# EasyEDA Pro project easyeda.eprj, schematic bl808_m1s

## Sheets
1 bl808_m1s
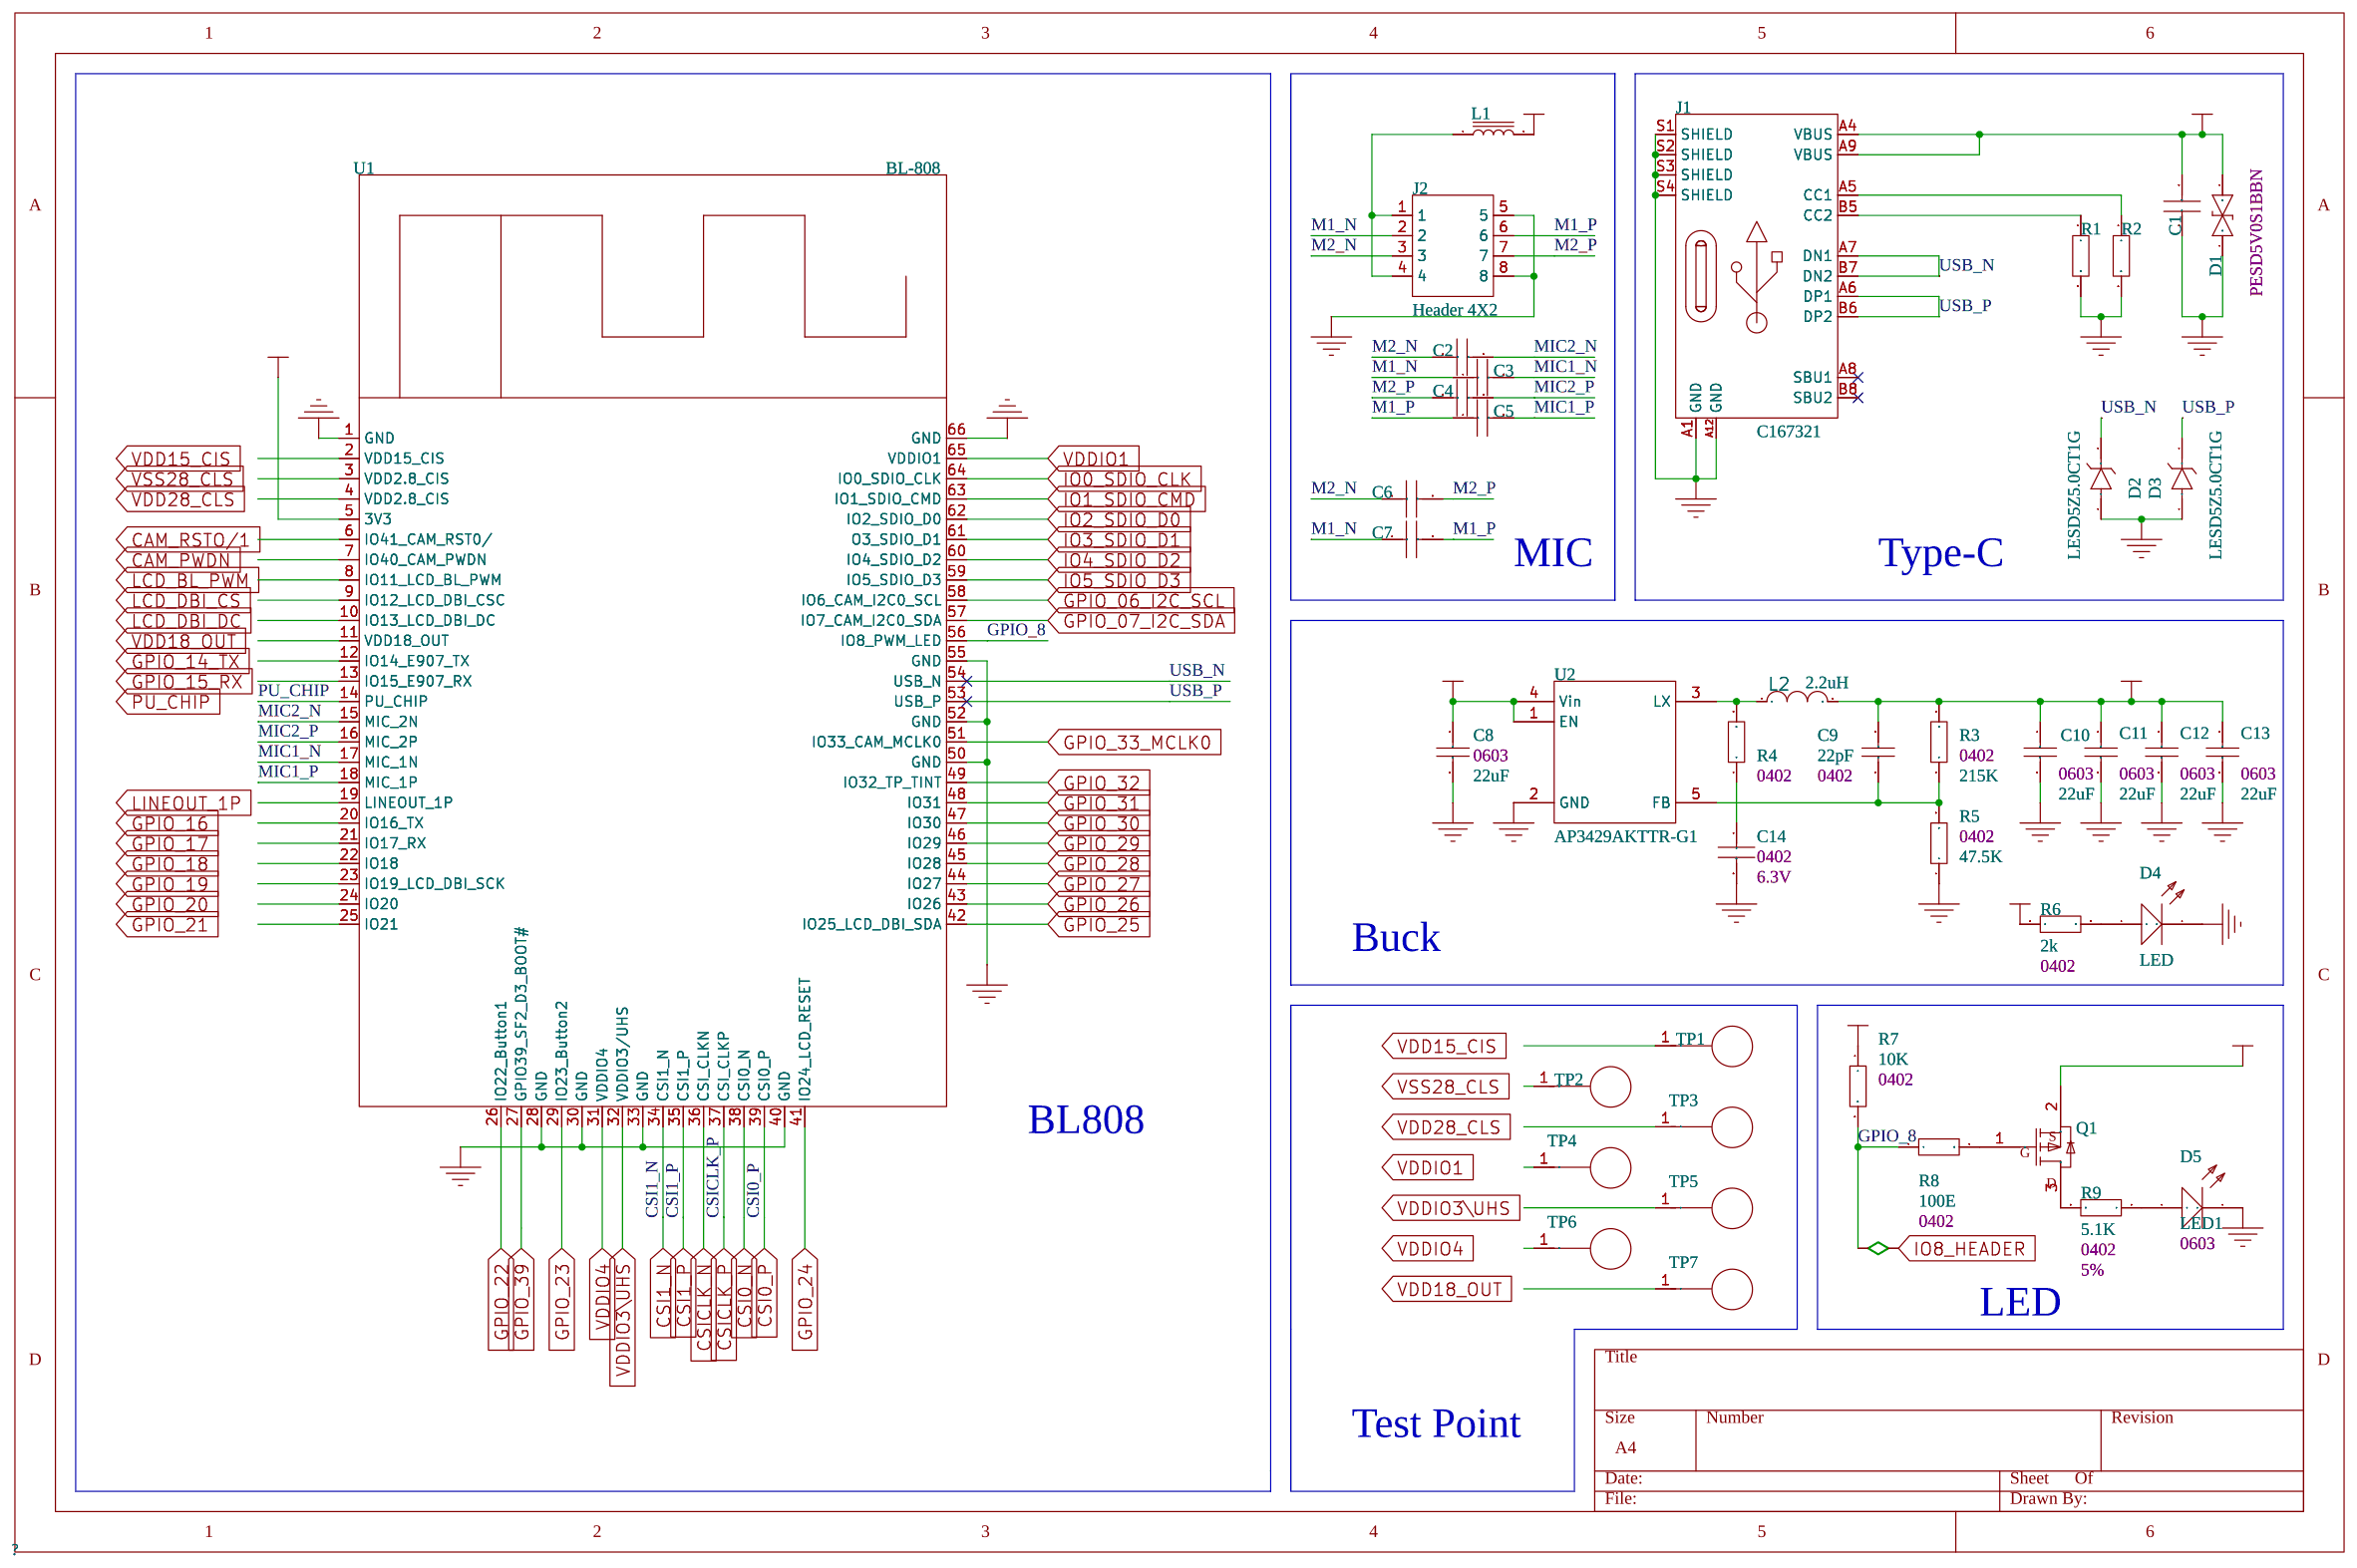
[diagram p0: bl808_m1s]
2 CAM_DISP
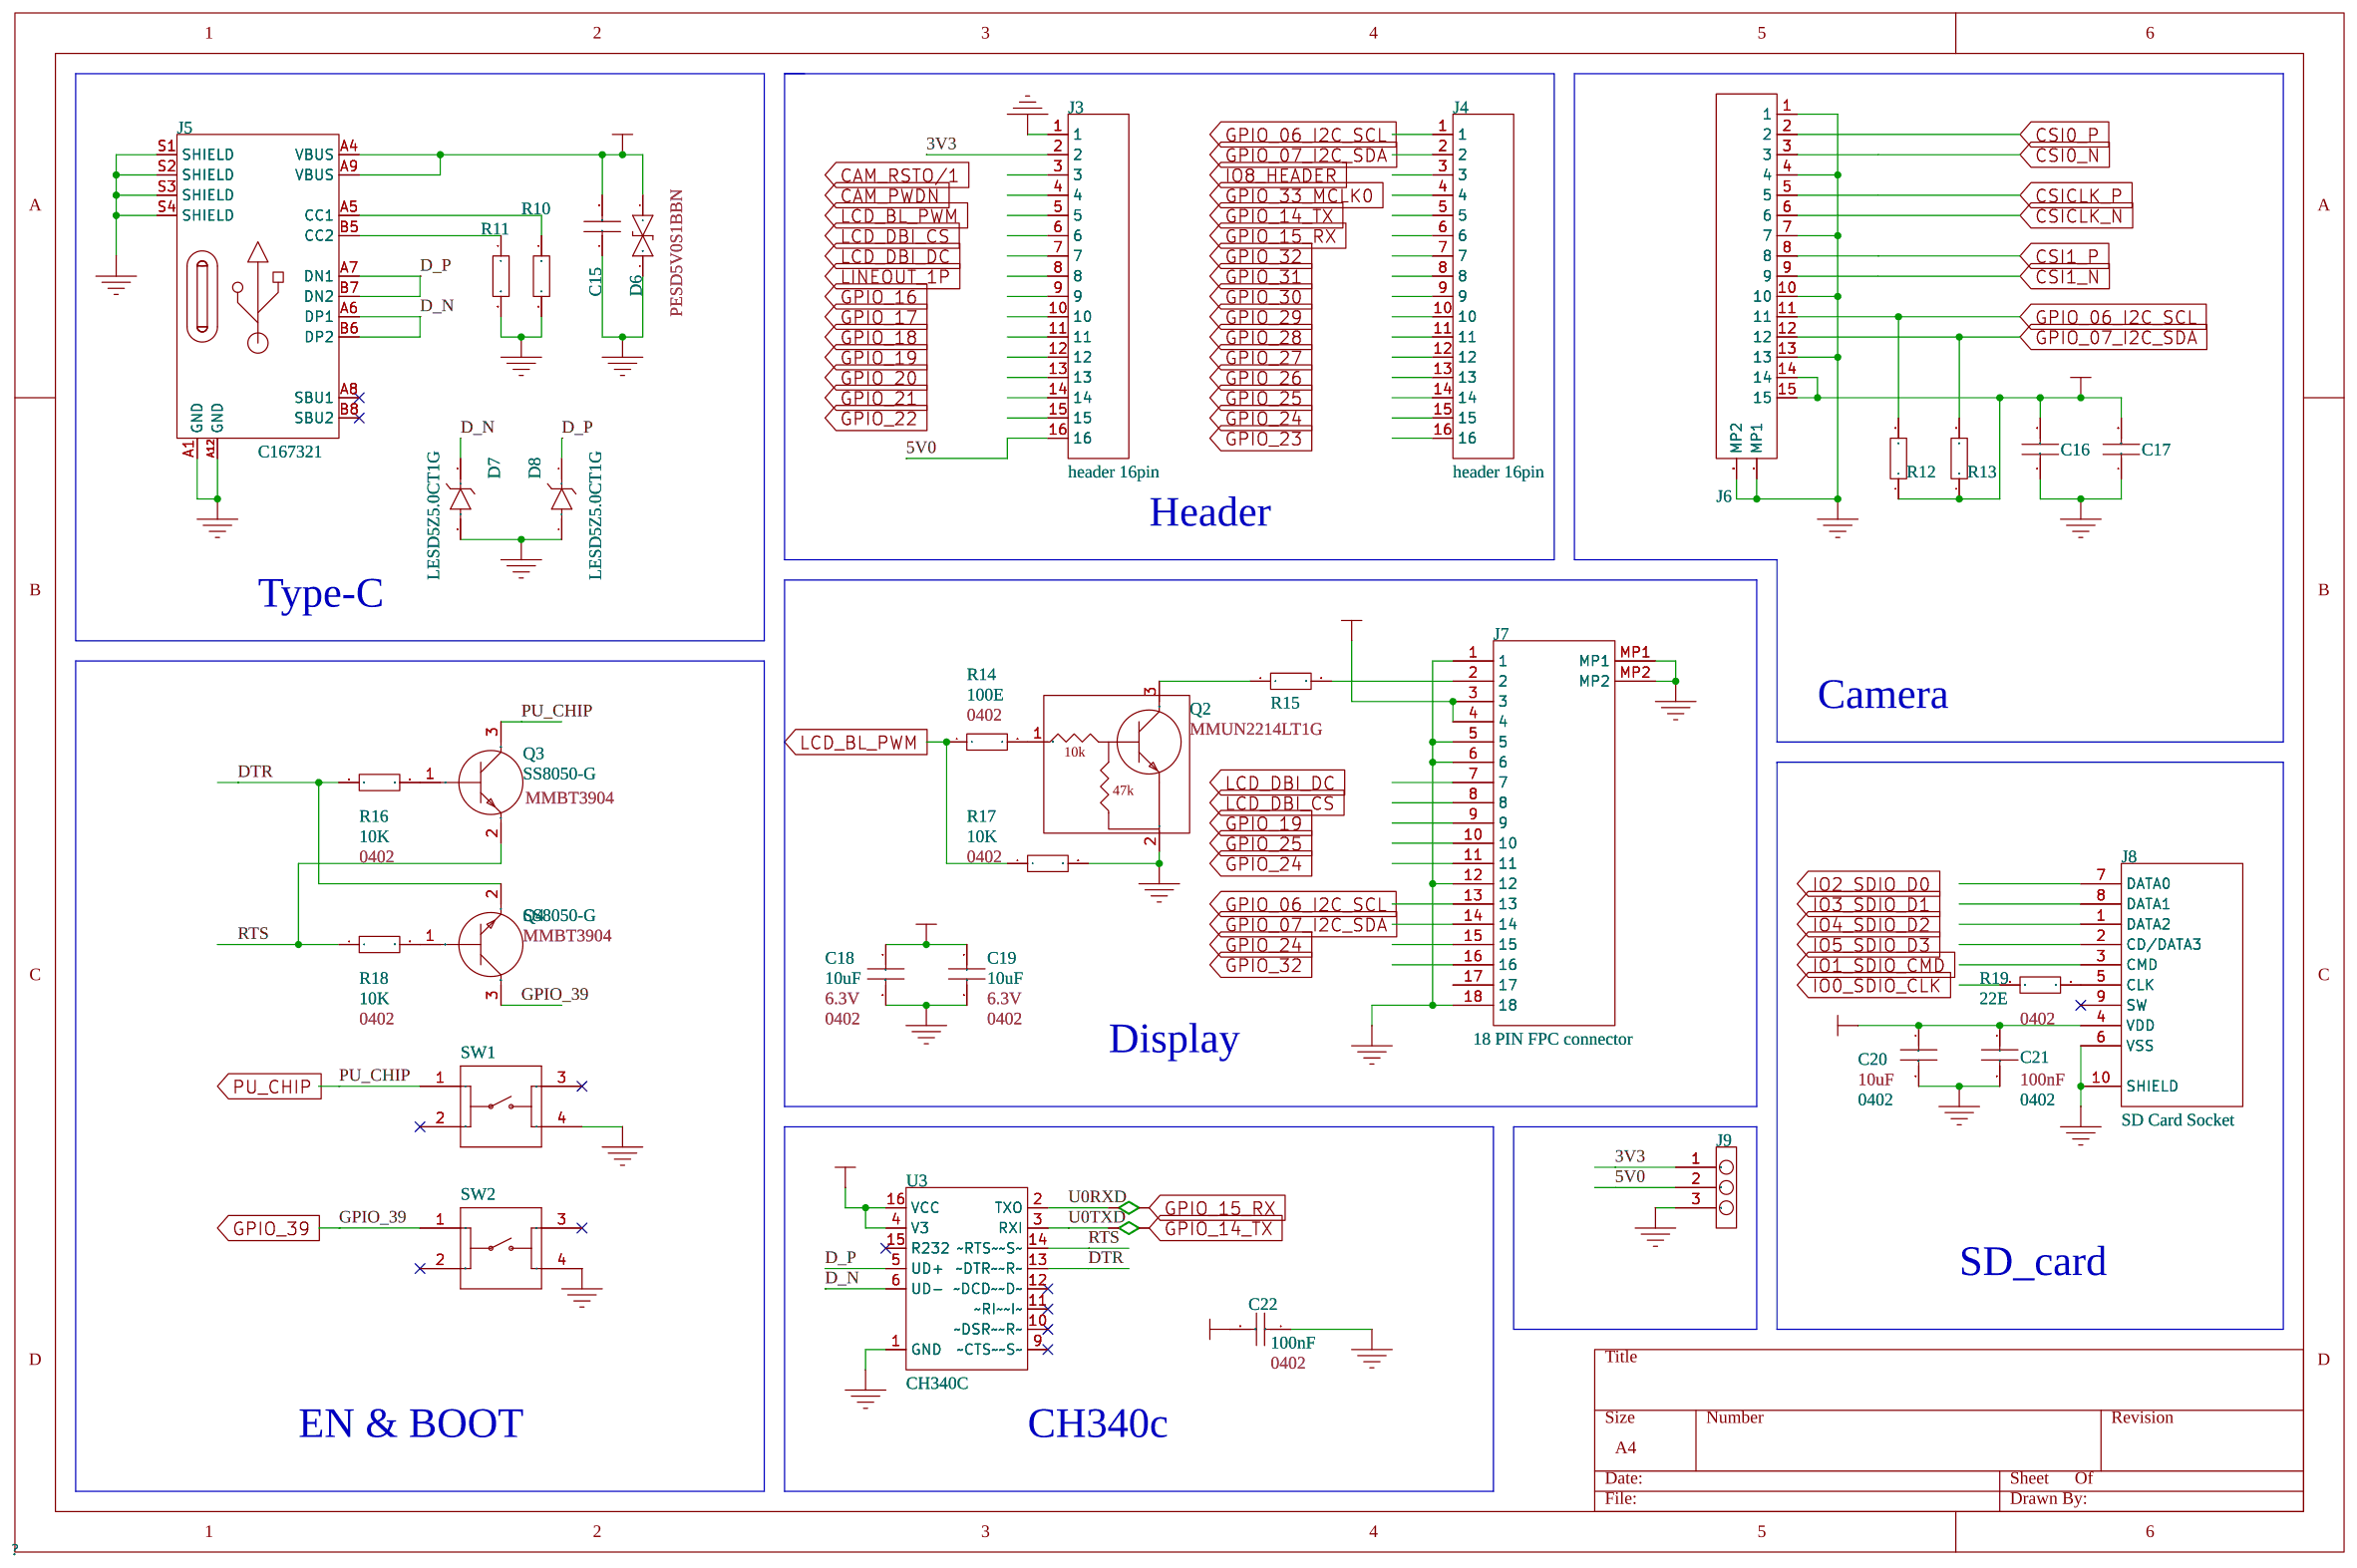
[diagram p1: CAM_DISP]

## Parts
sheet bl808_m1s
C1  22uF  [capc0805]
C2  100nF  [capc0805]
C3  100nF  [capc0805]
C4  100nF  [capc0805]
C5  100nF  [capc0805]
C6  *  [CAPC0402]
C7  *  [CAPC0402]
C8  22uF  [capc0603]
C9  22pF  [capc0402]
C10  22uF  [capc0603]
C11  22uF  [capc0603]
C12  22uF  [capc0603]
C13  22uF  [capc0603]
C14  *  [capc0805]
D1  PESD5V0S1BBN  [sod523]
D2  LESD5Z5.0CT1G  [sod523]
D3  LESD5Z5.0CT1G  [sod523]
D4  LED  [led_0603]
D5  LED1  [led_0603]
J1  C167321  [TYPE-C_usb]
J2  Header 4X2  [Header 2X4]
L1  Ferrite Bead  [C0805]
L2  2.2uH  [IND_4.0X4.0X2.0]
Q1  C148354  [SOT-23]
R1  5.1K  [resc0402]
R2  5.1K  [resc0402]
R3  215K  [resc0402]
R4  *  [resc0402]
R5  47.5K  [resc0402]
R6  2k  [resc0402]
R7  10K  [resc0402]
R8  100E  [resc0402]
R9  5.1K  [resc0402]
TP1  Test_Point  [TESTPOINT SMD]
TP2  Test_Point  [TESTPOINT SMD]
TP3  Test_Point  [TESTPOINT SMD]
TP4  Test_Point  [TESTPOINT SMD]
TP5  Test_Point  [TESTPOINT SMD]
TP6  Test_Point  [TESTPOINT SMD]
TP7  Test_Point  [TESTPOINT SMD]
U1  BL-808  [BL808 MODULE]
U2  AP3429AKTTR-G1  [SOT23-5]
sheet CAM_DISP
C15  22uF  [capc0805]
C16  22uF  [capc0805]
C17  22uF  [capc0805]
C18  10uF  [capc0805]
C19  10uF  [capc0805]
C20  0402  [capc0805]
C21  0402  [capc0805]
C22  100nF  [CAPC0402]
D6  PESD5V0S1BBN  [sod523]
D7  LESD5Z5.0CT1G  [sod523]
D8  LESD5Z5.0CT1G  [sod523]
J3  header 16pin  [HEADER 16 PIN 2.54]
J4  header 16pin  [HEADER 16 PIN 2.54]
J5  C167321  [TYPE-C_usb]
J6  MIPI  [15pin FPC conn hoirzontal]
J7  18 PIN FPC connector  [18 pin fpc]
J8  SD Card Socket  [SD card socket_MIX]
J9  Header 3 pin  [3 pin header]
Q2  Transistor NPN  [SOT95P240X115-3N]
Q3  SS8050-G  [SOT23-3]
Q4  SS8050-G  [SOT23-3]
R10  5.1K  [resc0402]
R11  5.1K  [resc0402]
R12  5.1K  [resc0402]
R13  10K  [resc0402]
R14  100E  [resc0402]
R15  5.1E  [resc0402]
R16  10K  [resc0402]
R17  10K  [resc0402]
R18  10K  [resc0402]
R19  22E  [resc0402]
SW1  Switch  [Micro Push Button 4 PAD]
SW2  Switch  [Micro Push Button 4 PAD]
U3  *  [ch340c]

## Library data of the parts
C1 = Cap: CAP CER 22uF 10V X5R 0402; Manufacturer Part Number: *; Voltage: 10v; Dielectric: *; Case/Package: 0805; Library Name: CUSTOM SCH
C2-C5 = Cap: CAP CER 100nF 3.3V X7R 0402; Manufacturer Part Number: *; Voltage: 3.3V; Dielectric: *; Case/Package: 0402; Library Name: CUSTOM SCH
C6 C7 = DNP: CAP CER uF 10V X5R 0402; Design Item ID: Cap; Library Name: CUSTOM SCH
C8 C10-C13 = Capacitor: CAP CER 22uF 10V X5R 0805; Manufacturer Part Number: *; Case/Package: 0603; Origin Footprint 2: CAPC0805; Library Name: Pd&apos;s Sch Lib
C9 = Capacitor: CAP CER 22pF 50V C0G 0402; Manufacturer Part Number: *; Case/Package: 0402; Origin Footprint 1: CAPC0402; Library Name: Pd&apos;s Sch Lib
C14 = Cap: CAP CER uF 10V X5R 0402; Voltage: 6.3V; Case/Package: 0402; Origin Footprint 1: capc0402; Library Name: CUSTOM SCH; Origin Footprint 2: capc0402
D1 D6 = PESD5V0S1BBN: 5V 6.5V Bidirectional 14V 3.5A (8/20us) SOD-523 TVS; Case/Package: SOD-523; Design Item ID: Bidirectional ESD Diode; Library Name: trolley
D2 D3 D7 D8 = LESD5Z5.0CT1G: ESD protection; Design Item ID: ESD DIODE_1; Library Name: CUSTOM SCH
D4 = LED: Case/Package: 0603; Library Name: Pd&apos;s Sch Lib
D5 = LED1: Typical RED GaAs LED; Manufacturer Part Number: LED; Case/Package: 0603; Library Name: CUSTOM SCH
J1 J5 = C167321: Type-C SMD USB Connectors,3A 16P Female; Manufacturer Part Number: 918-418K2023S40001; Case/Package: SMD; Design Item ID: TYPE-C; Library Name: CUSTOM SCH
J2 = Header 4X2: Headers &amp; Wire Housings ECONOSTIK HEADER DR VT TH 2X4; Case/Package: TH; Manufacturer Part Number: 10129381-908002BLF; Library Name: CUSTOM SCH
L1 = Ferrite Bead: Ferrite Beads 120ohms@100MHz 2A 0402; ComponentLink1URL: http://www.farnell.com/datasheets/1685938.pdf?src-supplier=Element14; ComponentLink1Description: http://www.farnell.com/datasheets/1685938.pdf?src-supplier=Element14; ComponentLink2URL: https://assets.lairdtech.com/home/brandworld/files/LI0805H151R-10.pdf?src-supplier=Digi-Key; ComponentLink2Description: https://assets.lairdtech.com/home/brandworld/files/LI0805H151R-10.pdf?src-supplier=Digi-Key; ComponentLink3URL: https://www.alliedelec.com/m/d/63159f83fbe70e1160794b0cc8ac128f.pdf?src-supplier=Allied+Electronics; ComponentLink3Description: https://www.alliedelec.com/m/d/63159f83fbe70e1160794b0cc8ac128f.pdf?src-supplier=Allied+Electronics; Manufacturer Part Number: MPZ1005S121HT000; Current: 2A; Impedance @ Frequency: 120ohms; Case/Package: 0402; Library Name: CUSTOM SCH
L2 = Inductor: SMD Power Inductors RoHS; Manufacturer Part Number: SRN4018-2R2M; Library Name: Pd&apos;s Sch Lib
Q1 = C148354: P-Channel -20V, -7.1A, 19m?, SOT-23; ComponentLink1URL: http://www.vishay.com/docs/68645/si2302cd.pdf?src-supplier=Avnet; ComponentLink1Description: http://www.vishay.com/docs/68645/si2302cd.pdf?src-supplier=Avnet; ComponentLink2URL: http://www.farnell.com/datasheets/1719572.pdf?src-supplier=Element14; ComponentLink2Description: http://www.farnell.com/datasheets/1719572.pdf?src-supplier=Element14; ComponentLink3URL: http://www.vishay.com/docs/68645/si2302cd.pdf?src-supplier=Future+Electronics; ComponentLink3Description: http://www.vishay.com/docs/68645/si2302cd.pdf?src-supplier=Future+Electronics; ComponentLink4URL: http://www.vishay.com/docs/68645/si2302cds.pdf?src-supplier=Digi-Key; ComponentLink4Description: http://www.vishay.com/docs/68645/si2302cds.pdf?src-supplier=Digi-Key; Manufacturer Part Number: WST2339; ComponentLink5URL: http://www.mccsemi.com/up_pdf/SI2302(SOT-23).pdf?src-supplier=Digi-Key; ComponentLink5Description: http://www.mccsemi.com/up_pdf/SI2302(SOT-23).pdf?src-supplier=Digi-Key; Origin Footprint 2: SOT95P240X115-3N; Design Item ID: MOSFET PMOS; Library Name: CUSTOM SCH
R1 R2 = RES: Thick Film Resistor -  5.1kohm, 1%, 0402; Manufacturer Part Number: *; Case/Package: 0402; Tolerance: *; Origin Footprint 2: RESC0402; Library Name: CUSTOM SCH
R3 = RES: Thick Film Resistor -  215kohm, 1%, 0402; Manufacturer Part Number: *; Case/Package: 0402; Tolerance: *; Origin Footprint 2: RESC0402; Library Name: CUSTOM SCH
R4 = RES: Thick Film Resistor -  ohm, 1%, 0402; Case/Package: 0402; Library Name: CUSTOM SCH; Origin Footprint 3: RESC0402
R5 = RES: Thick Film Resistor -  47.5kohm, 1%, 0402; Manufacturer Part Number: *; Case/Package: 0402; Tolerance: *; Origin Footprint 2: RESC0402; Library Name: CUSTOM SCH
R6 = RES: Thick Film Resistor -  2kohm, 1%, 0402; Manufacturer Part Number: *; Case/Package: 0402; Tolerance: *; Origin Footprint 2: RESC0402; Library Name: CUSTOM SCH
R7 = RES: Thick Film Resistor -  10kohm, 1%, 0402; Manufacturer Part Number: *; Case/Package: 0402; Tolerance: *; Origin Footprint 2: RESC0402; Library Name: CUSTOM SCH
R8 R14 = RES: Thick Film Resistor -  100ohm, 1%, 0402; Manufacturer Part Number: *; Case/Package: 0402; Tolerance: *; Origin Footprint 2: RESC0402; Library Name: CUSTOM SCH
R9 = RES: Thick Film Resistor - 5.1kohm, 1%, 0402; Manufacturer Part Number: *; Case/Package: 0402; Tolerance: 5%; Origin Footprint 2: RESC0201; Origin Footprint 1: RESC0402; Library Name: CUSTOM SCH; Origin Footprint 4: RESC0402
TP1-TP7 = Test_Point: Library Name: CUSTOM SCH
U1 = BL-808: Library Name: CUSTOM SCH
U2 = AP3429AKTTR-G1: IC REG BUCK ADJ 2A SYNC TSOT25; Case/Package: SOT-23-5; Library Name: Pd&apos;s Sch Lib
C15 = Cap: CAP CER 22uF 10V X5R 0402; Manufacturer Part Number: *; Voltage: 10V; Dielectric: *; Case/Package: 0805; Library Name: CUSTOM SCH
C16 C17 = Cap: CAP CER 22uF 10V X5R 0402; Manufacturer Part Number: *; Voltage: 6.3V; Dielectric: *; Case/Package: 0402; Library Name: CUSTOM SCH
C18 C19 = Cap: CAP CER 10uF 10V X5R 0402; Manufacturer Part Number: *; Voltage: 6.3V; Dielectric: *; Case/Package: 0402; Library Name: CUSTOM SCH
C20 = Cap: CAP CER 10uF 10V X5R 0402; Manufacturer Part Number: *; Voltage: 10uF; Dielectric: *; Case/Package: *; Library Name: CUSTOM SCH
C21 = Cap: CAP CER 100nF 10V X5R 0402; Manufacturer Part Number: *; Voltage: 100nF; Dielectric: *; Case/Package: *; Library Name: CUSTOM SCH
C22 = Cap: Ceramic Capacitor,100nF,0603,6.3V; Case/Package: 0402; Manufacturer Part Number: *; Library Name: VEGG_Schlib
J3 J4 = header 16pin: 16 pin header 2.54 mm; Library Name: CUSTOM SCH
J6 = MIPI: 15 Position FPC Connector Contacts, Vertical - 1 Sided Pitch  0.039&quot; (1.00mm); Case/Package: SMD; Manufacturer Part Number: 1-1734248-5; Design Item ID: FPC 15 Pin; Library Name: CUSTOM SCH
J7 = 18 PIN FPC connector: 18 pin fpc cable connector; Library Name: CUSTOM SCH
J8 = SD Card Socket: Memory Card Connectors TFR PUSH PUSH TYPE V YPE VSS DEECT SWITCH; Manufacturer Part Number: TF-018B-H15; Case/Package: SMD; Origin Footprint 2: 473521001; Library Name: CUSTOM SCH
J9 = Header 3 pin: Library Name: CUSTOM SCH
Q2 = Transistor NPN: Bipolar Transistors - Pre-Biased 100mA 50V BRT NPN; Supplier 1: Mouser; Manufacturer: ON Semiconductor; Stock 1: 56410; Pricing 1: 1=0.12, 10=0.105, 50=0.105, 100=0.037, 1000=0.025, 10000=0.017 (USD); Case/Package: SOT-23-3; Number of Pins: 3; Contact Plating: Tin,Matte; Min Operating Temperature: -55°C; Max Operating Temperature: 150°C; Package Quantity: 1; Collector Emitter Voltage (VCEO): 50V; Max Power Dissipation: 246mW; hFE Min: 80; Packaging: Tape and Reel; Max Collector Current: 100mA; Collector Emitter Breakdown Voltage: 50V; Polarity: NPN; Max Breakdown Voltage: 50V; Collector Emitter Saturation Voltage: 250mV; Element Configuration: Single; Max Output Current: 100mA; Operating Supply Voltage: 50V; Continuous Collector Current: 100mA; Power Dissipation: 246mW; Voltage Rating (DC): 50V; Current Rating: 100mA; Length: 2.9mm; Height: 0.94mm; Width: 1.3mm; Radiation Hardening: No; Lead Free: Lead Free; Halogen Free: Halogen Free; REACH SVHC: No SVHC; ComponentLink1URL: http://www.onsemi.ru.com/pub/Collateral/DTC114Y-D.PDF?src-supplier=Avnet+Europe; ComponentLink1Description: http://www.onsemi.ru.com/pub/Collateral/DTC114Y-D.PDF?src-supplier=Avnet+Europe; ComponentLink2URL: https://www.verical.com/server-webapp/html/getDatasheet?partID=38473&amp;src-supplier=Verical; ComponentLink2Description: https://www.verical.com/server-webapp/html/getDatasheet?partID=38473&amp;src-supplier=Verical; ComponentLink3URL: http://www.onsemi.com/pub/Collateral/DTC114Y-D.PDF?src-supplier=Digi-Key; ComponentLink3Description: http://www.onsemi.com/pub/Collateral/DTC114Y-D.PDF?src-supplier=Digi-Key; ComponentLink4URL: http://www.onsemi.com/pub/Collateral/DTC114Y-D.PDF?src-supplier=Future+Electronics; ComponentLink4Description: http://www.onsemi.com/pub/Collateral/DTC114Y-D.PDF?src-supplier=Future+Electronics; Supplier Part Number 1: 863-MMUN2214LT1G; Manufacturer Part Number: MMUN2214LT1G; Library Name: CUSTOM SCH
Q3 Q4 = SS8050-G: Bipolar Transistors - BJT NPN TRANSISTOR 1.5A 40V; Supplier 1: Mouser; Manufacturer: Comchip; Manufacturer Part Number: MMBT3904; Stock 1: 704; Pricing 1: 1=0.23, 10=0.15, 50=0.15, 100=0.068, 1000=0.043, 10000=0.028 (USD); Mount: Surface Mount; Case/Package: SOT-23-3; Packaging: Tape and Reel; Max Collector Current: 1.5A; Collector Emitter Voltage (VCEO): 400mV; Max Power Dissipation: 300mW; Transition Frequency: 100MHz; Collector Emitter Breakdown Voltage: 25V; Max Breakdown Voltage: 25V; Library Name: CUSTOM TNY290PG
R10-R13 = RES: Thick Film Resistor -  5.1Kohm, 1%, 0402; Manufacturer Part Number: *; Case/Package: 0402; Tolerance: *; Origin Footprint 2: RESC0402; Library Name: CUSTOM SCH
R15 = RES: Thick Film Resistor -  5.1ohm, 1%, 0402; Manufacturer Part Number: *; Case/Package: 0402; Tolerance: *; Origin Footprint 2: RESC0402; Library Name: CUSTOM SCH
R16-R18 = RES: Thick Film Resistor -  10Kohm, 1%, 0402; Manufacturer Part Number: *; Case/Package: 0402; Tolerance: *; Origin Footprint 2: RESC0402; Library Name: CUSTOM SCH
R19 = RES: Thick Film Resistor -  22ohm, 1%, 0402; Manufacturer Part Number: *; Case/Package: 0402; Tolerance: *; Origin Footprint 2: RESC0402; Library Name: CUSTOM SCH
SW1 SW2 = Switch: Design Item ID: Button; Library Name: trolley
U3 = CH340C: USB to serial chip CH340; Origin Footprint 2: SO016; Library Name: CUSTOM SCH

## Nets
3V3: C9.2 C10.1 C11.1 C12.1 C13.1 C16.2 C17.2 C18.1 C19.1 C20.1 C21.1 C22.2 J3.2 J6.14 J6.15 J7.3 J7.4 J8.4(VDD) J9.1 L1.2 L2.2 Q1.2(S) R3.2 R6.1 R7.1 R12.1 R13.1 U1.5(3V3) U3.4(V3) U3.16(VCC)
5V0: C1.2 C8.1 C15.2 D1.K(1) D6.K(1) J1.A4(VBUS) J1.A9(VBUS) J3.16 J5.A4(VBUS) J5.A9(VBUS) J9.2 U2.1(EN) U2.4(Vin)
GND: C1.1 C8.2 C10.2 C11.2 C12.2 C13.2 C14.2 C15.1 C16.1 C17.1 C18.2 C19.2 C20.2 C21.2 C22.1 D1.A(2) D2.A D3.A D4.K D5.K D6.A(2) D7.A D8.A J1.A1(GND) J1.A12(GND) J1.S1(SHIELD) J1.S2(SHIELD) J1.S3(SHIELD) J1.S4(SHIELD) J2.5 J2.8 J3.1 J5.A1(GND) J5.A12(GND) J5.S1(SHIELD) J5.S2(SHIELD) J5.S3(SHIELD) J5.S4(SHIELD) J6.1 J6.4 J6.7 J6.10 J6.13 J6.MP1 J6.MP2 J7.1 J7.5 J7.6 J7.12 J7.18 J7.MP1 J7.MP2 J8.6(VSS) J8.10(SHIELD) J9.3 Q2.2(E) R1.2 R2.2 R5.1 R10.2 R11.2 R17.2 SW1.4 SW2.4 U1.1(GND) U1.28(GND) U1.30(GND) U1.33(GND) U1.40(GND) U1.50(GND) U1.52(GND) U1.55(GND) U1.66(GND) U2.2(GND) U3.1(GND)
VDD15_CIS: TP1.1 U1.2(VDD15_CIS)
VDD18_OUT: TP7.1 U1.11(VDD18_OUT)
VDD28_CLS: TP3.1 U1.4(VDD2.8_CIS)
VDDIO1: TP4.1 U1.65(VDDIO1)
VDDIO3\UHS: U1.32(VDDIO3/UHS)
VDDIO4: U1.31(VDDIO4)
VSS28_CLS: TP2.1 U1.3(VDD2.8_CIS)
CAM_PWDN: J3.4 U1.7(IO40_CAM_PWDN)
CAM_RSTO/1: J3.3 U1.6(IO41_CAM_RST0/)
CSI0_N: J6.3 U1.38(CSI0_N)
CSI0_P: J6.2 U1.39(CSI0_P)
CSI1_N: J6.9 U1.34(CSI1_N)
CSI1_P: J6.8 U1.35(CSI1_P)
CSICLK_N: J6.6 U1.36(CSI_CLKN)
CSICLK_P: J6.5 U1.37(CSI_CLKP)
D_N: D7.K J5.A6(DP1) J5.B6(DP2) U3.6(UD-)
D_P: D8.K J5.A7(DN1) J5.B7(DN2) U3.5(UD+)
DTR: Q4.2(E) R16.1 U3.13(~DTR~~R~)
GPIO_06_I2C_SCL: J6.11 R12.2 U1.58(IO6_CAM_I2C0_SCL)
GPIO_07_I2C_SDA: J6.12 R13.2 U1.57(IO7_CAM_I2C0_SDA)
GPIO_8: J4.3 R7.2 R8.1 U1.56(IO8_PWM_LED)
GPIO_14_TX: J4.5 U1.12(IO14_E907_TX) U3.3(RXI)
GPIO_15_RX: J4.6 U1.13(IO15_E907_RX) U3.2(TXO)
GPIO_16: J3.9 U1.20(IO16_TX)
GPIO_17: J3.10 U1.21(IO17_RX)
GPIO_18: J3.11 U1.22(IO18)
GPIO_19: J3.12 J7.9 U1.23(IO19_LCD_DBI_SCK)
GPIO_20: J3.13 U1.24(IO20)
GPIO_21: J3.14 U1.25(IO21)
GPIO_22: J3.15 U1.26(IO22_Button1)
GPIO_23: J4.16 U1.29(IO23_Button2)
GPIO_24: J4.15 J7.11 J7.15 U1.41(IO24_LCD_RESET)
GPIO_25: U1.42(IO25_LCD_DBI_SDA)
GPIO_26: U1.43(IO26)
GPIO_27: U1.44(IO27)
GPIO_28: U1.45(IO28)
GPIO_29: U1.46(IO29)
GPIO_30: U1.47(IO30)
GPIO_31: U1.48(IO31)
GPIO_32: U1.49(IO32_TP_TINT)
GPIO_33_MCLK0: U1.51(IO33_CAM_MCLK0)
GPIO_39: Q4.3(C) SW2.1 U1.27(GPIO39_SF2_D3_BOOT#)
IO0_SDIO_CLK: R19.1 U1.64(IO0_SDIO_CLK)
IO1_SDIO_CMD: J8.3(CMD) U1.63(IO1_SDIO_CMD)
IO2_SDIO_D0: J8.7(DATA0) U1.62(IO2_SDIO_D0)
IO3_SDIO_D1: J8.8(DATA1) U1.61(O3_SDIO_D1)
IO4_SDIO_D2: J8.1(DATA2) U1.60(IO4_SDIO_D2)
IO5_SDIO_D3: J8.2(CD/DATA3) U1.59(IO5_SDIO_D3)
LCD_BL_PWM: J3.5 R14.1 R17.1 U1.8(IO11_LCD_BL_PWM)
LCD_DBI_CS: J3.6 J7.8 U1.9(IO12_LCD_DBI_CSC)
LCD_DBI_DC: J3.7 J7.7 U1.10(IO13_LCD_DBI_DC)
LINEOUT_1P: J3.8 U1.19(LINEOUT_1P)
M1_N: C3.1 C7.1 J2.2
M1_P: C5.1 C7.2 J2.6
M2_N: C2.1 C6.1 J2.3
M2_P: C4.1 C6.2 J2.7
MIC1_N: C3.2 U1.17(MIC_1N)
MIC1_P: C5.2 U1.18(MIC_1P)
MIC2_N: C2.2 U1.15(MIC_2N)
MIC2_P: C4.2 U1.16(MIC_2P)
PU_CHIP: Q3.3(C) SW1.1 U1.14(PU_CHIP)
RTS: Q3.2(E) R18.1 U3.14(~RTS~~S~)
USB_N: D2.K J1.A7(DN1) J1.B7(DN2) U1.54(USB_N)
USB_P: D3.K J1.A6(DP1) J1.B6(DP2) U1.53(USB_P)
Net-(D4-A): D4.A R6.2
NETC9_1: C9.1 R3.1 R5.2 U2.5(FB)
NETC14_1: C14.1 R4.1
NETD5_A: D5.A R9.1
NETJ1_A5: J1.A5(CC1) R2.1
NETJ1_B5: J1.B5(CC2) R1.1
NETJ2_1: J2.1 J2.4 L1.1
NETJ5_A5: J5.A5(CC1) R10.1
NETJ5_B5: J5.B5(CC2) R11.1
NETJ7_2: J7.2 R15.2
NETJ8_5: J8.5(CLK) R19.2
NETL2_1: L2.1 R4.2 U2.3(LX)
NETQ1_1: Q1.1(G) R8.2
NETQ1_3: Q1.3(D) R9.2
NETQ2_1: Q2.1(B) R14.2
NETQ2_3: Q2.3(C) R15.1
NETQ3_1: Q3.1(B) R16.2
NETQ4_1: Q4.1(B) R18.2

Not connected (* = marked no-connect by the designer): J1 A8(SBU1)* B8(SBU2)*; J4 1 2 4 7 8 9 10 11 12 13 14; J5 A8(SBU1)* B8(SBU2)*; J7 10 13 14 16 17; J8 9(SW)*; SW1 2* 3*; SW2 2* 3*; TP5 1; TP6 1; U3 9(~CTS~~S~)* 10(~DSR~~R~)* 11(~RI~~I~)* 12(~DCD~~D~)* 15(R232)*

## Notes on the sheets
sheet 1
- MIC
- Type-C
- Buck
- BL808
- LED
- Test Point
sheet 2
- Header
- Type-C
- Camera
- Display
- SD_card
- EN & BOOT
- CH340c
